# EAGLE design Altimeter-Barometer (EAGLE 6.5.0)
DESIGNER: theairboard.cc; REV: 1.0
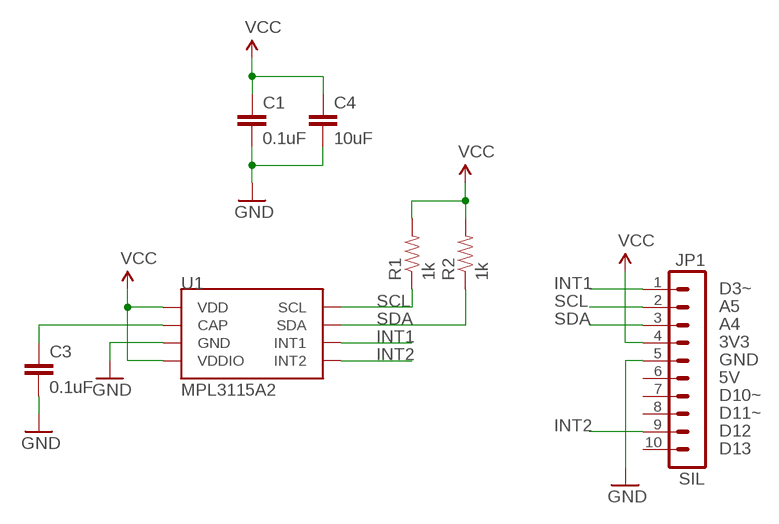
[diagram p0: schematic, sheet 1]

## Parts
C1  0.1uF  CAP0603-CAP  [0603-CAP]
C3  0.1uF  CAP0603-CAP  [0603-CAP]
C4  10uF  22UF-6.3V-20%(0805)  [0805]
JP1  SIL  1X10-SIL-CONNECTOR  [SIL-1X10]
R1  1k  RESISTOR0603-RES  [0603-RES]
R2  1k  RESISTOR0603-RES  [0603-RES]
U1  MPL3115A2  MPL3115A2LGA8  [LGA8]

## Nets
CAP: C3.1 U1.2(CAP)
GND: C1.2 C3.2 C4.2 JP1.5 U1.3(GND)
INT1: JP1.1 U1.6(INT1)
INT2: JP1.9 U1.5(INT2)
SCL: JP1.2 R1.1 U1.8(SCL)
SDA: JP1.3 R2.1 U1.7(SDA)
VCC: C1.1 C4.1 JP1.4 R1.2 R2.2 U1.1(VDD) U1.4(VDDIO)
Unconnected: JP1.6 JP1.7 JP1.8 JP1.10

## Notes on the sheet
- D3~
- A5
- A4
- 3V3
- GND
- 5V
- D10~
- D11~
- D12
- D13

## Library data of the parts
C1 C3 = SparkFun:CAP: Capacitor Standard 0603 ceramic capacitor, and 0.1" leaded capacitor.
C4 = SparkFun-Capacitors:22UF-6.3V-20%(0805): CAP-08402 Ceramic; PROD_ID: CAP-08402; VALUE: 22uF
JP1 = theairboard:1X10-SIL-CONNECTOR: BOARD-BOARD CONNECTOR HEADER, 1ROW www.farnell.com/datasheets/8281.pdf; MANUFACTURER: FCI; OC_FARNELL: 1097958; OC_NEWARK: 93K5133; PART_NUMBER: 77315-818-36LF
R1 R2 = SparkFun:RESISTOR: Resistor Basic schematic elements and footprints for 0603, 1206, and PTH resistors.
U1 = SparkFun-Sensors:MPL3115A2: Altimeter/Pressure Sensor, I2C, 1.95V-3.6V supply, 50 to 110kPa

## Board
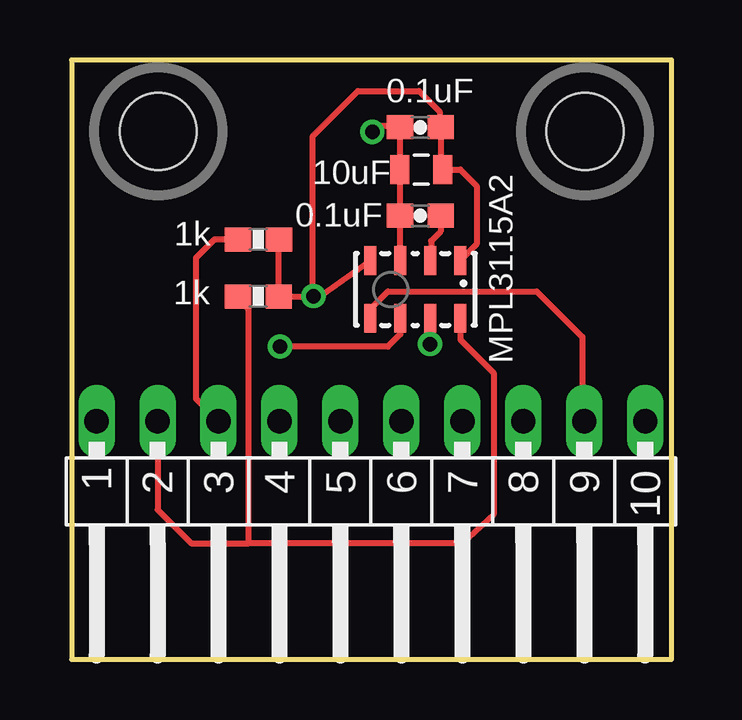
[diagram p1: board, top side]
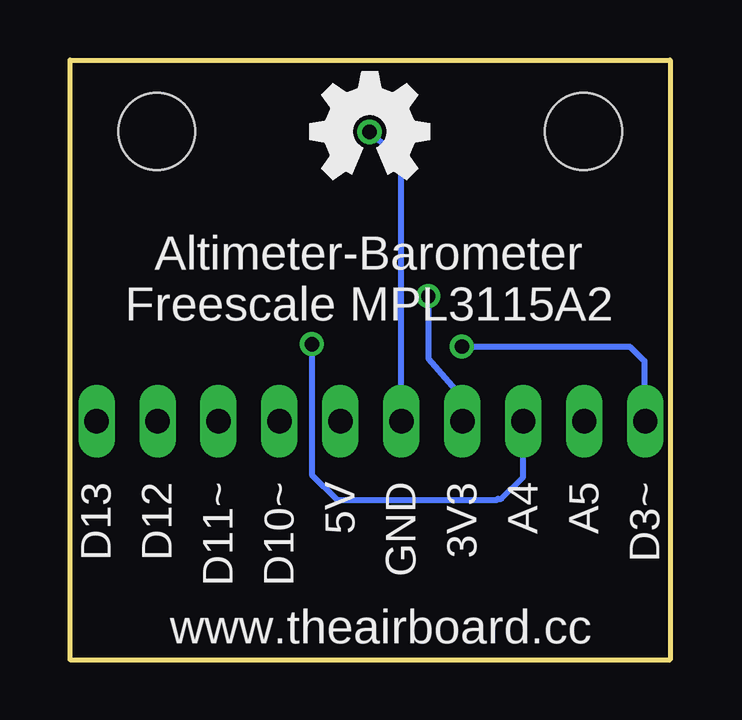
[diagram p2: board, bottom side, seen from below]

Size 25 x 25 mm. Coordinates in mm from the lower left corner, seen from the top.
Copper layers (1*16): Top 0.035mm / dielectric 1.5mm / Bottom 0.035mm
Design rules "default": minimum track width 10mil, minimum drill 24mil, track to track 8mil, track to pad 8mil, pad to pad 8mil, via to via 8mil, smd to smd 8mil, copper to edge 40mil, drill to drill 8mil, minimum pad ring 10mil, minimum via ring 8mil, stop-mask expansion 4mil, vias tented up to drill 0mil, thermal gap 10mil

### Footprints (pad centres in the part's own frame; a part is rotated, then mirrored left to right if it is on the bottom)
0603-CAP = smd 1.1 x 1: 1 -0.85,0; 2 0.85,0
0805 = smd 0.8 x 1.2: 1 -0.9,0; 2 0.9,0
SIL-1X10 = drill 1.016 long: 1 11.43,0; 2 8.89,0; 3 6.35,0; 4 3.81,0; 5 1.27,0; 6 -1.27,0; 7 -3.81,0; 8 -6.35,0; 9 -8.89,0; 10 -11.43,0
0603-RES = smd 1.1 x 1: 1 -0.85,0; 2 0.85,0
LGA8 = smd 1.2 x 0.5: 1 -1.2,1.875; 2 -1.2,0.625; 3 -1.2,-0.625; 4 -1.2,-1.875; 5 1.2,-1.875; 6 1.2,-0.625; 7 1.2,0.625; 8 1.2,1.875
LAYOUT25X25 = hole 3.2: 21.61,22.275; 3.83,22.275

### Placement (x,y rotation side)
C1  14.53,22.19 180 top
C3  14.53,18.51 180 top
C4  14.57,20.43 180 top
FRAME1  SCH_FRAME  [BOARD_FRAME]  -108.22,-85.25 0 top  (outside the outline)
JP1  12.47,9.94 180 top
R1  7.78,15.14 0 top
R2  7.78,17.52 0 top
U1  14.32,15.43 270 top
U$2  [LAYOUT25X25]  -0.22,-0.25 0 top

### Tracks (layer width: path | path; a pad name or v marks a point on that pad's centre or on a via)
CAP
  Top 0.254: C3.1 15.38,17.85 14.98,17.45 14.98,16.66 U1.2
GND  (via drill 0.6)
  Top 0.254: U1.3 13.68,16.64 C3.2 C4.2 C1.2 13.62,22.25 12.78,22.25 v12.53,22
  Bottom 0.254: JP1.5 11.2,20.87 v12.53,22
INT1  (via drill 0.6)
  Top 0.254: U1.6 13.69,13.56 13.18,13.05 v8.68,13.05
  Bottom 0.254: v8.68,13.05 1.68,13.05 1.08,12.45 1.08,9.98 JP1.1
INT2
  Top 0.254: U1.5 12.44,14.62 13.18,15.35 19.38,15.35 21.28,13.45 21.28,10.02 JP1.9
SCL
  Top 0.254: U1.8 16.2,13.34 17.58,11.95 17.58,6.05 16.28,4.85 7.38,4.85 | 7.38,4.85 7.38,14.59 R1.1 | JP1.2 3.58,6.25 4.98,4.85 7.38,4.85
SDA  (via drill 0.6)
  Top 0.254: R2.1 5.95,17.52 5.18,16.75 5.18,10.88 JP1.3 | U1.7 14.94,13.16 v14.93,13.15
  Bottom 0.254: v14.93,13.15 14.93,7.7 13.88,6.65 7.23,6.65 7.18,6.7 7.03,6.7 6.13,7.6 JP1.3
VCC  (via drill 0.6)
  Top 0.254: R2.2 R1.2 10.05,15.14 | 10.05,15.14 10.37,15.14 | 10.37,15.14 v10.08,15.15 | U1.1 16.88,17.32 16.88,19.75 16.2,20.43 C4.1 15.38,20.52 C1.1 15.33,22.24 15.33,22.85 14.48,23.7 11.93,23.7 10.05,21.82 10.05,15.14 | 10.37,15.14 10.37,15.15 U1.4
  Bottom 0.254: v10.08,15.15 10.08,12.55 8.68,10.95 8.68,9.96 JP1.4

### Text on the board
bNames: Altimeter-Barometer / Freescale MPL3115A2